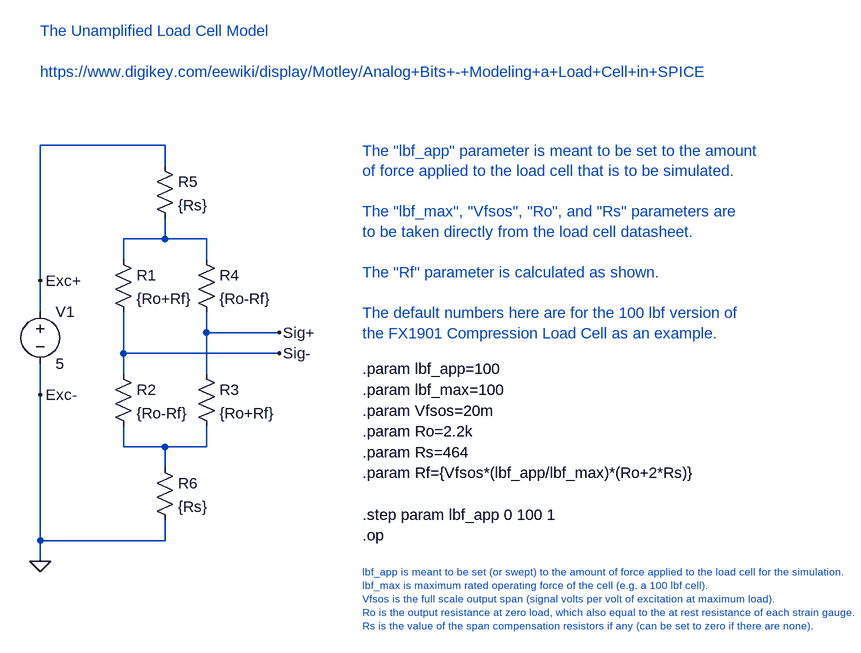
[diagram p0: schematic unamplified-load-cell_01.asc]
unamplified-load-cell_01.asc, the LTspice schematic file:
Version 4
SHEET 1 2064 704
WIRE 128 -112 -64 -112
WIRE 128 -80 128 -112
WIRE 128 32 128 0
WIRE 128 32 64 32
WIRE 192 32 128 32
WIRE 64 64 64 32
WIRE 192 64 192 32
WIRE -64 96 -64 -112
WIRE -64 144 -64 96
WIRE 192 176 192 144
WIRE 304 176 192 176
WIRE 64 208 64 144
WIRE 304 208 64 208
WIRE 64 240 64 208
WIRE 192 240 192 176
WIRE -64 272 -64 224
WIRE 64 352 64 320
WIRE 128 352 64 352
WIRE 192 352 192 320
WIRE 192 352 128 352
WIRE 128 384 128 352
WIRE -64 496 -64 272
WIRE 128 496 128 464
WIRE 128 496 -64 496
WIRE -64 528 -64 496
FLAG -64 528 0
FLAG -64 96 Exc+
FLAG -64 272 Exc-
FLAG 304 176 Sig+
FLAG 304 208 Sig-
SYMBOL res 48 48 R0
SYMATTR InstName R1
SYMATTR Value {Ro+Rf}
SYMBOL res 48 224 R0
SYMATTR InstName R2
SYMATTR Value {Ro-Rf}
SYMBOL res 176 224 R0
SYMATTR InstName R3
SYMATTR Value {Ro+Rf}
SYMBOL res 176 48 R0
SYMATTR InstName R4
SYMATTR Value {Ro-Rf}
SYMBOL res 112 -96 R0
SYMATTR InstName R5
SYMATTR Value {Rs}
SYMBOL res 112 368 R0
SYMATTR InstName R6
SYMATTR Value {Rs}
SYMBOL voltage -64 128 R0
SYMATTR InstName V1
SYMATTR Value 5
TEXT 432 328 Left 2 !.param Ro=2.2k
TEXT 432 264 Left 2 !.param lbf_max=100
TEXT 432 296 Left 2 !.param Vfsos=20m
TEXT 432 392 Left 2 !.param Rf={Vfsos*(lbf_app/lbf_max)*(Ro+2*Rs)}
TEXT 432 456 Left 2 !.step param lbf_app 0 100 1
TEXT 432 488 Left 2 !.op
TEXT -64 -288 Left 2 ;The Unamplified Load Cell Model\n \nhttps://www.digikey.com/eewiki/display/Motley/Analog+Bits+-+Modeling+a+Load+Cell+in+SPICE
TEXT 432 -104 Left 2 ;The "lbf_app" parameter is meant to be set to the amount \nof force applied to the load cell that is to be simulated.\n \nThe "lbf_max", "Vfsos", "Ro", and "Rs" parameters are \nto be taken directly from the load cell datasheet.\n \nThe "Rf" parameter is calculated as shown.\n \nThe default numbers here are for the 100 lbf version of \nthe FX1901 Compression Load Cell as an example.
TEXT 432 544 Left 1 ;lbf_app is meant to be set (or swept) to the amount of force applied to the load cell for the simulation.\nlbf_max is maximum rated operating force of the cell (e.g. a 100 lbf cell).\nVfsos is the full scale output span (signal volts per volt of excitation at maximum load).\nRo is the output resistance at zero load, which also equal to the at rest resistance of each strain gauge.\nRs is the value of the span compensation resistors if any (can be set to zero if there are none).
TEXT 432 232 Left 2 !.param lbf_app=100
TEXT 432 360 Left 2 !.param Rs=464

The netlist it stands for:
* unamplified-load-cell_01.asc
R1 N001 Sig- {Ro+Rf}
R2 Sig- N002 {Ro-Rf}
R3 Sig+ N002 {Ro+Rf}
R4 N001 Sig+ {Ro-Rf}
R5 Exc+ N001 {Rs}
R6 N002 0 {Rs}
V1 Exc+ 0 5
.param Ro=2.2k
.param lbf_max=100
.param Vfsos=20m
.param Rf={Vfsos*(lbf_app/lbf_max)*(Ro+2*Rs)}
.step param lbf_app 0 100 1
.op
* The Unamplified Load Cell Model
* https://www.digikey.com/eewiki/display/Motley/Analog+Bits+-+Modeling+a+Load+Cell+in+SPICE
* The "lbf_app" parameter is meant to be set to the amount
* of force applied to the load cell that is to be simulated.
* The "lbf_max", "Vfsos", "Ro", and "Rs" parameters are
* to be taken directly from the load cell datasheet.
* The "Rf" parameter is calculated as shown.
* The default numbers here are for the 100 lbf version of
* the FX1901 Compression Load Cell as an example.
* lbf_app is meant to be set (or swept) to the amount of force applied to the load cell for the simulation.
* lbf_max is maximum rated operating force of the cell (e.g. a 100 lbf cell).
* Vfsos is the full scale output span (signal volts per volt of excitation at maximum load).
* Ro is the output resistance at zero load, which also equal to the at rest resistance of each strain gauge.
* Rs is the value of the span compensation resistors if any (can be set to zero if there are none).
.param lbf_app=100
.param Rs=464
.backanno
.end